# Altium project opo4.PrjPCB
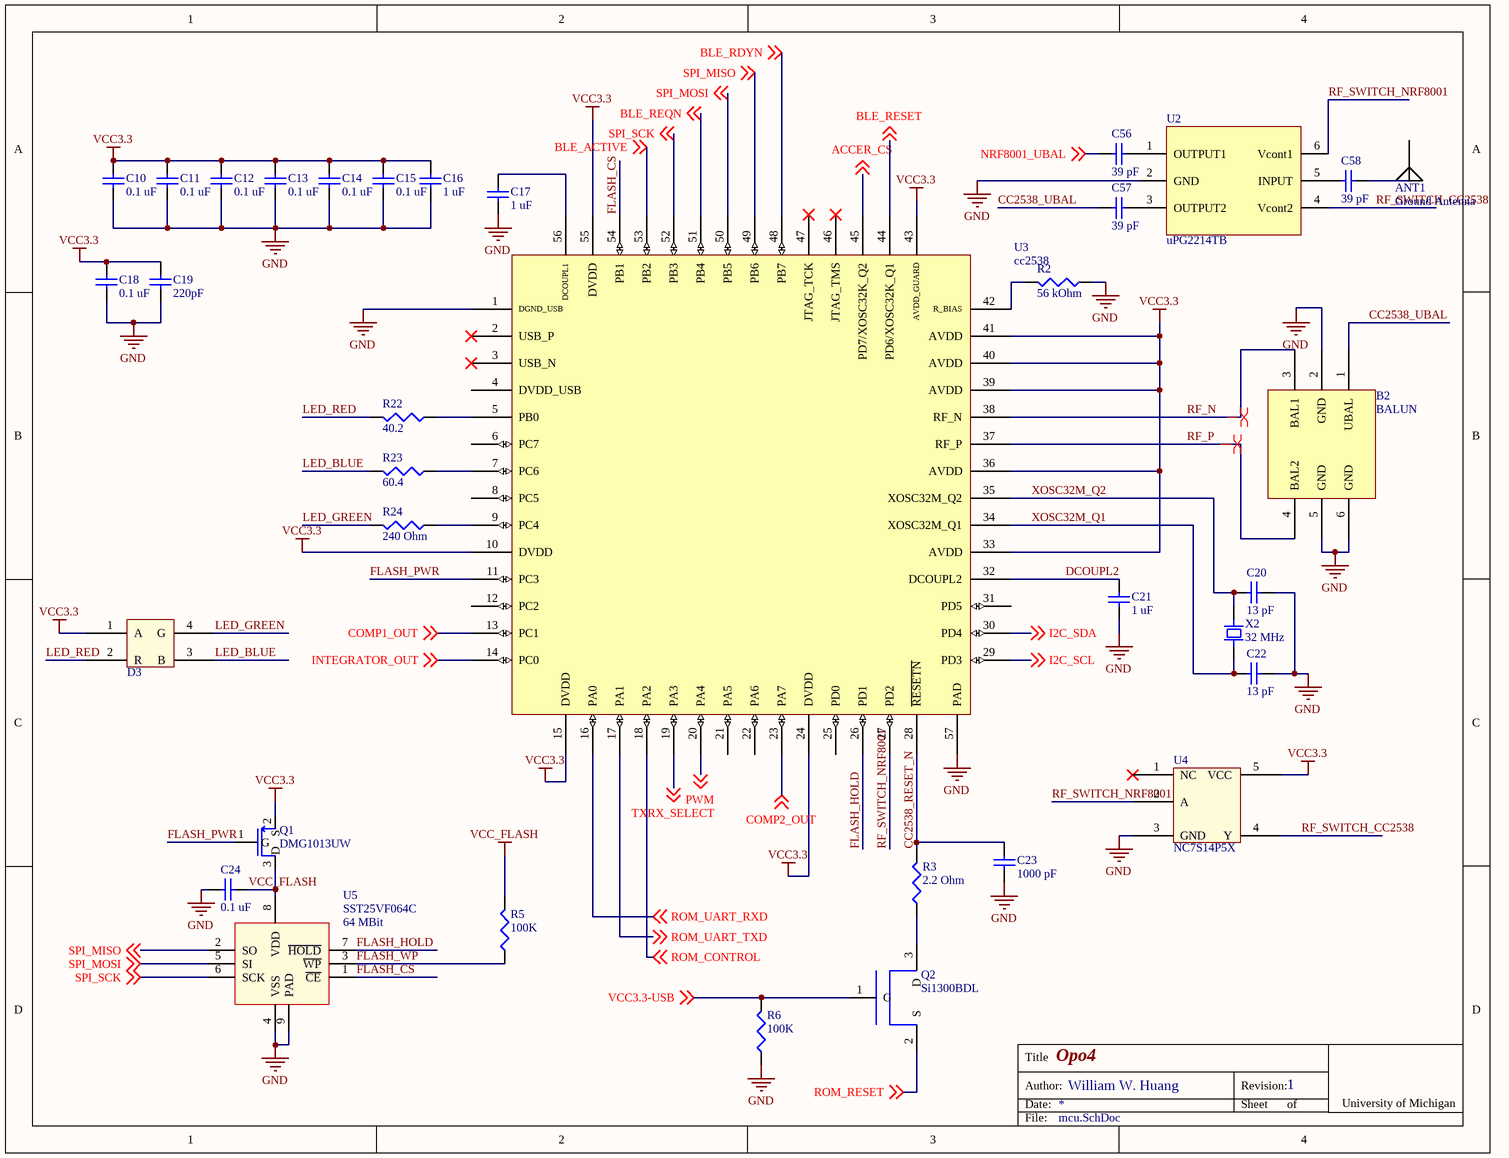
[diagram p0: mcu.SchDoc]
6 sheets, 110 parts. Net scope: global (net labels, ports and power ports of the same name join across sheets).
Board file: opo4.PcbDoc
Sheets:
  mcu.SchDoc
  power.SchDoc
  programmer_charger.SchDoc
  bluetooth.SchDoc
  ul_rx.SchDoc
  ul_tx_ctrl.SchDoc

## Sheet mcu.SchDoc: Opo4
size Letter; Author: William W. Huang; Organization: Altium Limited; Address1: L3, 12a Rodborough Rd; Address2: Frenchs Forest; Address3: NSW; Address4: Australia 2086; Revision: 1

### Parts
ANT1  Ground Antenna  [SMD Ground Antenna]
B2  BALUN  [2450BM15A0002]
C10  value 0.1 uF  [0402]  (hidden comment: Ceramic capacitor)
C11  value 0.1 uF  [0402]  (hidden comment: Ceramic capacitor)
C12  value 0.1 uF  [0402]  (hidden comment: Ceramic capacitor)
C13  value 0.1 uF  [0402]  (hidden comment: Ceramic capacitor)
C14  value 0.1 uF  [0402]  (hidden comment: Ceramic capacitor)
C15  value 0.1 uF  [0402]  (hidden comment: Ceramic capacitor)
C16  value 1 uF  [0402]  (hidden comment: Ceramic capacitor)
C17  value 1 uF  [0402]  (hidden comment: Ceramic capacitor)
C18  value 0.1 uF  [0402]  (hidden comment: Ceramic capacitor)
C19  value 220pF  [0402]  (hidden comment: 220pF 0402 ceramic cap)
C20  value 13 pF  [0402]  (hidden comment: 13pf 0402 Cap)
C21  value 1 uF  [0402]  (hidden comment: Ceramic capacitor)
C22  value 13 pF  [0402]  (hidden comment: 13pf 0402 Cap)
C23  value 1000 pF  [0402]  (hidden comment: Ceramic capacitor)
C24  value 0.1 uF  [0402]  (hidden comment: Ceramic capacitor)
C56  value 39 pF  [0402]  (hidden comment: Ceramic Capacitor)
C57  value 39 pF  [0402]  (hidden comment: Ceramic Capacitor)
C58  value 39 pF  [0402]  (hidden comment: Ceramic Capacitor)
D3  Tri Color LED  [0404]  (value not drawn)
Q1  DMG1013UW  [SC70-3]
Q2  Si1300BDL  [SC70-3]
R2  value 56 kOhm  [0402]  (hidden comment: 56k 0402 Res)
R3  value 2.2 Ohm  [0402]  (hidden comment: 2.2 Ohm 0402 Res)
R5  value 100K  [0402]  (hidden comment: Chip resistor)
R6  value 100K  [0402]  (hidden comment: Chip resistor)
R22  value 40.2  [0201]  (hidden comment: Chip Resistor)
R23  value 60.4  [0201]  (hidden comment: Chip resistor)
R24  value 240 Ohm  [0201]  (hidden comment: Chip resistor)
U2  uPG2214TB  [minimold-6]
U3  cc2538  [QFN50P800X800X100_HS-57N]
U4  NC7S14P5X  [SC70-5]
U5  SST25VF064C  Capacity: 64 MBit  [WSON]
X2  value 32 MHz  [FA-128]  (hidden comment: 32 MHz Crystal)

### Nets
GND: B2.2(GND) B2.5(GND) B2.6(GND) C10.2 C11.2 C12.2 C13.2 C14.2 C15.2 C16.2 C17.2 C18.2 C19.2 C20.2 C21.2 C22.1 C23.2 C24.1 R2.2 R6.2 U2.2(GND) U3.1(DGND_USB) U3.57(PAD) U4.3(GND) U5.4(VSS) U5.9(PAD)
VCC3.3: C10.1 C11.1 C12.1 C13.1 C14.1 C15.1 C16.1 C18.1 C19.1 D3.1(A) Q1.2(S) U3.10(DVDD) U3.15(DVDD) U3.24(DVDD) U3.33(AVDD) U3.36(AVDD) U3.39(AVDD) U3.40(AVDD) U3.41(AVDD) U3.43(AVDD_GUARD) U3.55(DVDD) U4.5(VCC)
VCC_FLASH: C24.2 Q1.3(D) R5.1 U5.8(VDD)
ACCER_CS: U3.45(PD7/XOSC32K_Q2) ; off-sheet ACCER_CS
BLE_ACTIVE: U3.53(PB2) ; off-sheet BLE_ACTIVE
BLE_RDYN: U3.48(PB7) ; off-sheet BLE_RDYN
BLE_REQN: U3.51(PB4) ; off-sheet BLE_REQN
BLE_RESET: U3.44(PD6/XOSC32K_Q1) ; off-sheet BLE_RESET
CC2538_RESET_N: C23.1 R3.1 U3.28(~{RESETN})
CC2538_UBAL: B2.1(UBAL) C57.2
COMP1_OUT: U3.13(PC1) ; off-sheet COMP1_OUT
COMP2_OUT: U3.23(PA7) ; off-sheet COMP2_OUT
DCOUPL2: C21.1 U3.32(DCOUPL2)
FLASH_CS: U3.54(PB1) U5.1(~{CE})
FLASH_HOLD: U3.26(PD1) U5.7(~{HOLD})
FLASH_PWR: Q1.1(G) U3.11(PC3)
FLASH_WP: R5.2 U5.3(~{WP})
I2C_SCL: U3.29(PD3) ; off-sheet I2C_SCL
I2C_SDA: U3.30(PD4) ; off-sheet I2C_SDA
INTEGRATOR_OUT: U3.14(PC0) ; off-sheet INTEGRATOR_OUT
LED_BLUE: D3.3(B) R23.1
LED_GREEN: D3.4(G) R24.1
LED_RED: D3.2(R) R22.1
NRF8001_UBAL: C56.1 ; off-sheet NRF8001_UBAL
PWM: U3.20(PA4) ; off-sheet PWM
RF_N: B2.3(BAL1) U3.38(RF_N)
RF_P: B2.4(BAL2) U3.37(RF_P)
RF_SWITCH_CC2538: U2.4(Vcont2) U4.4(Y)
RF_SWITCH_NRF8001: U2.6(Vcont1) U3.27(PD2) U4.2(A)
ROM_CONTROL: U3.18(PA2) ; off-sheet ROM_CONTROL
ROM_RESET: Q2.2(S) ; off-sheet ROM_RESET
ROM_UART_RXD: U3.16(PA0) ; off-sheet ROM_UART_RXD
ROM_UART_TXD: U3.17(PA1) ; off-sheet ROM_UART_TXD
SPI_MISO: U3.49(PB6) U5.2(SO) ; off-sheet SPI_MISO
SPI_MOSI: U3.50(PB5) U5.5(SI) ; off-sheet SPI_MOSI
SPI_SCK: U3.52(PB3) U5.6(SCK) ; off-sheet SPI_SCK
TXRX_SELECT: U3.19(PA3) ; off-sheet TXRX_SELECT
VCC3.3-USB: Q2.1(G) R6.1 ; off-sheet VCC3.3-USB
XOSC32M_Q1: C22.2 U3.34(XOSC32M_Q1) X2.3
XOSC32M_Q2: C20.1 U3.35(XOSC32M_Q2) X2.1
NetC17_1: C17.1 U3.56(DCOUPL1)
NetC56_2: C56.2 U2.1(OUTPUT1)
NetC57_1: C57.1 U2.3(OUTPUT2)
NetC58_1: C58.1 U2.5(INPUT)
NetQ2_3: Q2.3(D) R3.2
NetR2_1: R2.1 U3.42(R_BIAS)
NetR22_2: R22.2 U3.5(PB0)
NetR23_2: R23.2 U3.7(PC6)
NetR24_2: R24.2 U3.9(PC4)

Not connected (* = marked no-connect by the designer): ANT1 1; C58 2; U3 2(USB_P)* 3(USB_N)* 4(DVDD_USB) 6(PC7) 8(PC5) 12(PC2) 21(PA5) 22(PA6) 25(PD0) 31(PD5) 46(JTAG_TMS)* 47(JTAG_TCK)*; U4 1(NC)*

### Layout directives
differential pair: RF_N, RF_P

### Notes on the sheet
- Title
- Date:
- Author:
- Revision:
- Sheet
- of
- University of Michigan
- File:

### Library data of the parts
ANT1 = Molex Antenna: Molex 2.4 GHz SMD On-Ground Antenna; Supplier 1: Digikey; Supplier Part Number 1: WM4893CT-ND
B2 = cc2538_Balun: Johanson CC253X Balun; Mfr: Johanson Technology; Supplier 1: Digikey; Supplier Part Number 1: 712-1536-1-ND; Mfr Part Number: 2450BM15A0002
C10-C15 C18 C24 = C_0.1u_0402_ceramic: Ceramic capacitor, 0.1u, 0402 package; Manufacture: TDK; voltage rated: 10 V; tolerance: 10%; Supplier 1: Digi-Key; Supplier Part Number 1: 445-1265-1-ND; package: 0402
C16 C17 C21 = C_1u_0402_ceramic: Ceramic capacitor, 1 uF, 0402 package; Manufacture: TDK; voltage rated: 6.3 V; tolerance: 10%; package: 0402; Supplier 1: Digi-Key; Supplier Part Number 1: 445-5000-1-ND
C19 = C_220pf_0402_ceramic: 220pF 5% 50 V C0G NP0 0402 ceramic cap; Mfr: Murata; Mfr Part Number: GRM1555C1H221JA01D; Supplier 1: Digikey; Supplier Part Number 1: 490-1293-1-ND
C20 C22 = C_13p_0402: 13pf, 50V, 2%, c0G, NP0, 0402, ceramic; Mfr: Murata; Mfr Part Number: GRM1555C1H130GA01D; Supplier 1: Digikey; Supplier Part Number 1: 490-8184-1-ND
C23 = C_1000p_0402_ceramic: Ceramic capacitor, 1000 pF, 0402 package; Manufacture: TDK; voltage rated: 50 V; tolerance: 10%; package: 0402; Supplier 1: Digi-Key; Supplier Part Number 1: 445-6846-1-ND
C56-C58 = C_39pf_0402_ceramic: Ceramic capacitor, 0402, 39 pF, 5%, C0G, NP0, RF suitable; Supplier 1: Digikey; Supplier Part Number 1: 720-1288-1-ND
D3 = D_LED_RGB_0404: LED, RGB, 0404; Supplier 1: Digikey; Supplier Part Number 1: SMLP34RGB2W3CT-ND
Q1 = DMG1013UW: P-CHANNEL ENHANCEMENT MODE MOSFET; Supplier 1: Digi-Key; Supplier Part Number 1: DMG1013UW-7DICT-ND
Q2 = Si1300BDL: MOSFET N-CH D-S 20V SC-70-3; Supplier 1: Digi-Key; Supplier Part Number 1: SI1300BDL-T1-GE3CT-ND
R2 = R_56K_0402: 56 kOhm, 1%, .0603 W, 0402; Mfr: Rohm; Mfr Part Number: MCR01MRTF5602; Supplier 1: Digikey; Supplier Part Number 1: RHM56.0KCDCT-ND
R3 = R_2.2_0402: 2.2 Ohm, 1%, .063W, 0402; Mfr: Vishay Dale; Mfr Part Number: CRCW04022R20FKED; Supplier 1: Digikey; Supplier Part Number 1: 541-2.20LLCT-ND
R5 R6 = R_100K_0402: Chip resistor, 100K, 0402 package; tolerance: 1%; power: 1/16 W; Supplier 1: Digi-Key; Supplier Part Number 1: 541-100KLCT-ND; package: 0402
R22 = R_40.2_0201: 40.2 Ohm 0201 1% Chip Resistor; Supplier 1: Digikey; Supplier Part Number 1: 1276-3586-1-ND
R23 = R_60.4_0201: 60.4 Ohm, .05W, 1% 0201 Chip Resistor; Supplier 1: DIgikey; Supplier Part Number 1: P60.4ABCT-ND
R24 = R_240_0201: 240 Ohm, 1%, .05W, 0201 Chip Resistor; Supplier 1: Digikey; Supplier Part Number 1: P240AGCT-ND
U2 = uPG2214TB: GaAs Integrated Circuit for L, S-Band SPDT Switch; Supplier 1: Digi-Key; Supplier Part Number 1: UPG2214TB-E4-ACT-ND
U3 = cc2538: cc2538 MCU/802.15.4 radio; Supplier 1: Digikey; Supplier Part Number 1: 296-35797-1-ND
U4 = NC7S14P5X: Single Inverter; Mfr: Fairchild; Mfr Part Number: NC7S14P5X; Supplier 1: Digikey; Supplier Part Number 1: NC7S14P5XDKR-ND
U5 = SST25VF064C: 64 Mbit SPI Serial Dual I/O Flash; Supplier 1: Digi-Key; Supplier Part Number 1: SST25VF064C-80-4I-Q2AE-CT-ND
X2 = X_32M_FA-128: 32MHz, 10ppm, 10pF, 60 Ohm; Mfr: Epson; Mfr Part Number: FA-128 32.0000MF20X-K3; Supplier 1: Digikey; Supplier Part Number 1: SER3800CT-ND

## Sheet power.SchDoc: Opo4
size Letter; Author: William W. Huang; Organization: Altium Limited; Address1: L3, 12a Rodborough Rd; Address2: Frenchs Forest; Address3: NSW; Address4: Australia 2086; Revision: 1
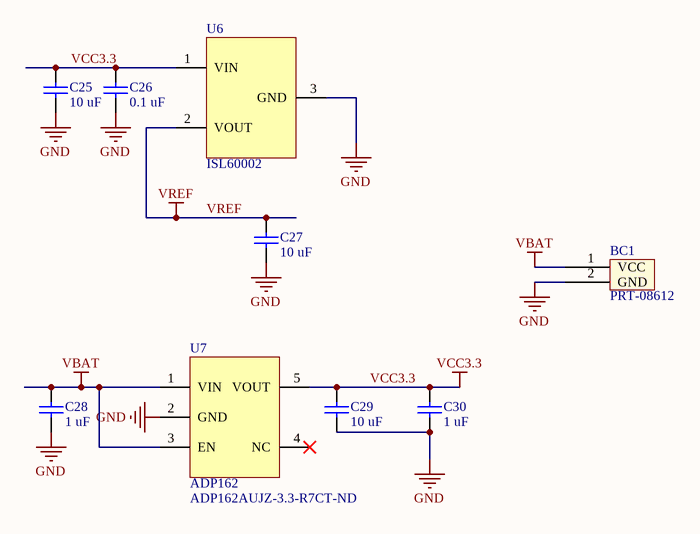
[diagram p1: power.SchDoc]

### Parts
BC1  PRT-08612  [JST PH 2PIN]
C25  value 10 uF  [0603]  (hidden comment: Ceramic capacitor)
C26  value 0.1 uF  [0402]  (hidden comment: Ceramic capacitor)
C27  value 10 uF  [0603]  (hidden comment: Ceramic capacitor)
C28  value 1 uF  [0402]  (hidden comment: Ceramic capacitor)
C29  value 10 uF  [0603]  (hidden comment: Ceramic capacitor)
C30  value 1 uF  [0402]  (hidden comment: Ceramic capacitor)
U6  ISL60002  [SOT23-3N]
U7  ADP162  Supplier Part Number 1: ADP162AUJZ-3.3-R7CT-ND  [TSOT23-5]

### Nets
GND: BC1.2(GND) C25.2 C26.2 C27.2 C28.2 C29.2 C30.2 U6.3(GND) U7.2(GND)
VBAT: BC1.1(VCC) C28.1 U7.1(VIN) U7.3(EN)
VCC3.3: C25.1 C26.1 C29.1 C30.1 U6.1(VIN) U7.5(VOUT)
VREF: C27.1 U6.2(VOUT)

Not connected (* = marked no-connect by the designer): BC1 3 4; U7 4(NC)*

### Notes on the sheet
- Title
- Date:
- Author:
- Revision:
- Sheet
- of
- University of Michigan
- File:

### Library data of the parts
BC1 = JST-PH-2mm-2Pin: 2-pin JST-PH 2mm Battery Connector; Supplier 1: Sparkfun; Supplier Part Number 1: PRT-08612
C25 C27 C29 = C_10u_0603_ceramic: Ceramic capacitor, 10 uF, 0603 package; Manufacture: TDK; voltage rated: 6.3V; tolerance: 20%; package: 0603; Supplier 1: Digi-Key; Supplier Part Number 1: 445-4112-1-ND
C26 = C_0.1u_0402_ceramic: as C10 on sheet mcu; Supplier 1: Digi-Key; Supplier Part Number 1: 445-1265-1-ND; package: 0402
C28 C30 = C_1u_0402_ceramic: as C16 on sheet mcu; package: 0402; Supplier 1: Digi-Key; Supplier Part Number 1: 445-5000-1-ND
U6 = ISL60002: IC VREF SERIES PREC SOT-23-3; Supplier 1: Digi-Key; Supplier Part Number 1: ISL60002DIH310Z-TKCT-ND
U7 = ADP162: Ultralow Quiescent Current,  150 mA, CMOS Linear Regulators; Supplier 1: Digi-Key

## Sheet programmer_charger.SchDoc: Opo4
size Letter; Author: William W. Huang; Organization: Altium Limited; Address1: L3, 12a Rodborough Rd; Address2: Frenchs Forest; Address3: NSW; Address4: Australia 2086; Revision: 1
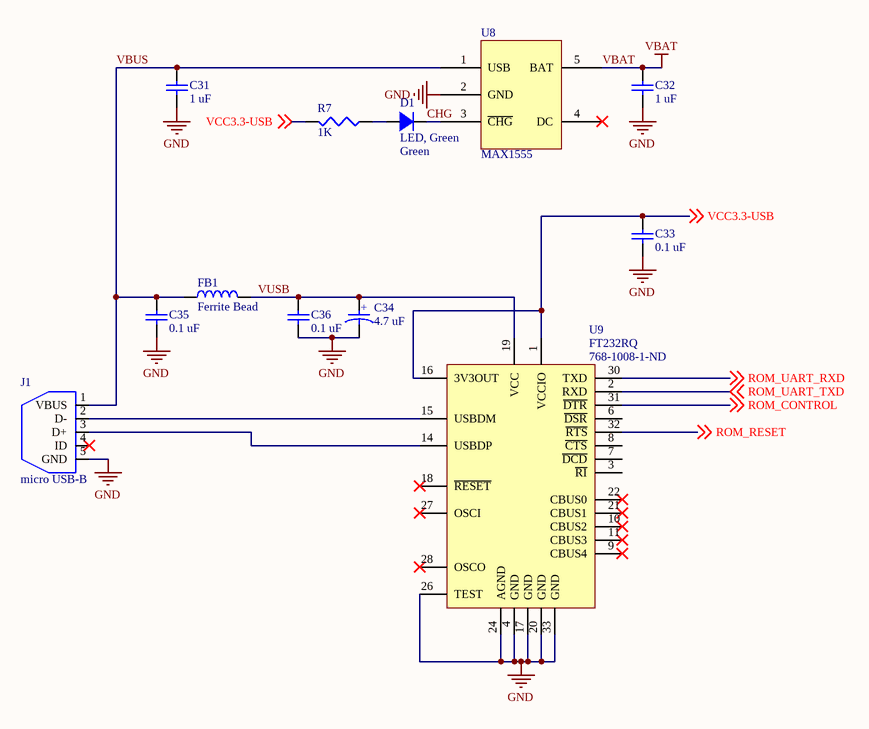
[diagram p2: programmer_charger.SchDoc]

### Parts
C31  value 1 uF  [0402]  (hidden comment: Ceramic capacitor)
C32  value 1 uF  [0402]  (hidden comment: Ceramic capacitor)
C33  value 0.1 uF  [0402]  (hidden comment: Ceramic capacitor)
C34  value 4.7 uF  [0603 - Polar Marking]  (hidden comment: Tantalum capacitor)
C35  value 0.1 uF  [0402]  (hidden comment: Ceramic capacitor)
C36  value 0.1 uF  [0402]  (hidden comment: Ceramic capacitor)
D1  LED, Green  Color: Green  [0402 - DIODE]
FB1  Ferrite Bead  [0402]
J1  micro USB-B  [Micro USB-B]
R7  value 1K  [0402]  (hidden comment: Chip resistor)
U8  MAX1555  [SOT23-5]
U9  FT232RQ  Supplier Part Number 1: 768-1008-1-ND  [QFN-32]

### Nets
GND: C31.2 C32.2 C33.2 C34.2 C35.2 C36.2 J1.5(GND) U8.2(GND) U9.4(GND) U9.17(GND) U9.20(GND) U9.24(AGND) U9.26(TEST) U9.33(GND)
VBAT: C32.1 U8.5(BAT)
CHG: D1.2 U8.3(~{CHG})
ROM_CONTROL: U9.31(~{DTR}) ; off-sheet ROM_CONTROL
ROM_RESET: U9.32(~{RTS}) ; off-sheet ROM_RESET
ROM_UART_RXD: U9.30(TXD) ; off-sheet ROM_UART_RXD
ROM_UART_TXD: U9.2(RXD) ; off-sheet ROM_UART_TXD
VBUS: C31.1 C35.1 FB1.2 J1.1(VBUS) U8.1(USB)
VCC3.3-USB: C33.1 R7.1 U9.1(VCCIO) U9.16(3V3OUT) ; off-sheet VCC3.3-USB
VUSB: C34.1 C36.1 FB1.1 U9.19(VCC)
NetD1_1: D1.1 R7.2
NetJ1_2: J1.2(D-) U9.15(USBDM)
NetJ1_3: J1.3(D+) U9.14(USBDP)

Not connected (* = marked no-connect by the designer): J1 4(ID)*; U8 4(DC)*; U9 3(~{RI}) 6(~{DSR}) 7(~{DCD}) 8(~{CTS}) 9(CBUS4)* 10(CBUS2)* 11(CBUS3)* 18(~{RESET})* 21(CBUS1)* 22(CBUS0)* 27(OSCI)* 28(OSCO)*

### Notes on the sheet
- Title
- Date:
- Author:
- Revision:
- Sheet
- of
- University of Michigan
- File:
- (in symbol C_4.7u_0603_tantalum) +

### Library data of the parts
C31 C32 = C_1u_0402_ceramic: as C16 on sheet mcu; package: 0402; Supplier 1: Digi-Key; Supplier Part Number 1: 445-5000-1-ND
C33 C35 C36 = C_0.1u_0402_ceramic: as C10 on sheet mcu; Supplier 1: Digi-Key; Supplier Part Number 1: 445-1265-1-ND; package: 0402
C34 = C_4.7u_0603_tantalum: Tantalum capacitor, 4.7 uF, 0603 package; Manufacture: Rohm; voltage rated: 10 V; tolerance: 20%; package: 0603; Supplier 1: Digi-Key; Supplier Part Number 1: 511-1496-1-ND
D1 = D_LED_GREEN_0402: LED, Green,  0402; package: 0402; Supplier 1: Digi-Key; Supplier Part Number 1: 511-1592-1-ND
FB1 = FB_150mA_0402: Ferrite Bead, 150 mA, 0402 package; impedance@Freq: 1K@100 MHz; current rating: 150 mA; Supplier 1: Digi-Key; Supplier Part Number 1: 587-1835-1-ND; package: 0402
J1 = Micro USB: CONN USB MICRO B RECPT SMT R/A; Supplier 1: Digi-Key; Supplier Part Number 1: 609-4616-6-ND
R7 = R_1K_0402: Chip resistor, 1K, 0402 package; tolerance: 1%; power: 1/16 W; Supplier 1: Digi-Key; Supplier Part Number 1: 541-1.00KLCT-ND; package: 0402
U8 = MAX1555: 3 Dual-Input USB/AC Adapter 1-Cell Li+  Battery Chargers; Supplier 1: Digi-Key; Supplier Part Number 1: MAX1555EZK+TTR-ND
U9 = IC_FT232RQ: FT232R USB UART; Manufacturer: *; Note: *; ManufacturerPartNo: *; Supplier 1: Digi-Key

## Sheet bluetooth.SchDoc: Opo4
size Letter; Author: William W. Huang; Organization: Altium Limited; Address1: L3, 12a Rodborough Rd; Address2: Frenchs Forest; Address3: NSW; Address4: Australia 2086; Revision: 1
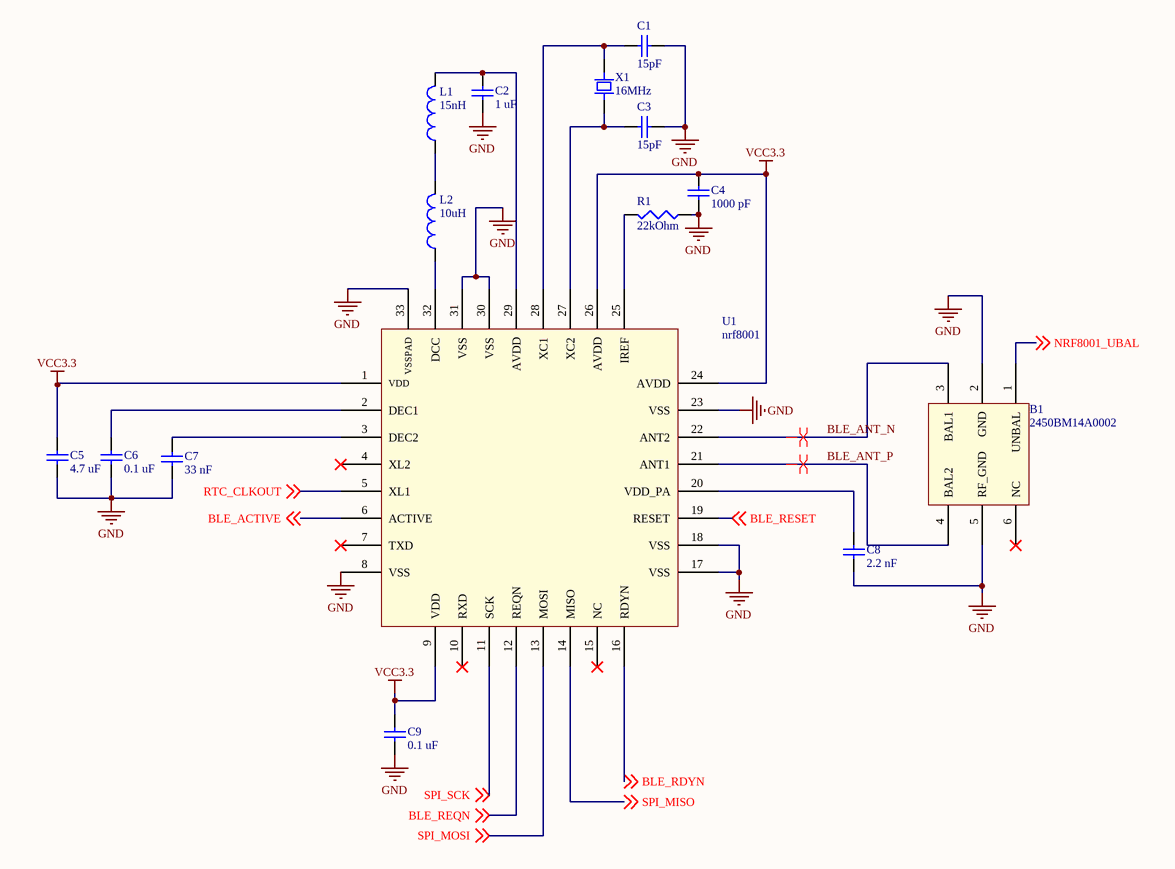
[diagram p3: bluetooth.SchDoc]

### Parts
B1  2450BM14A0002  [2450BM14A0002]
C1  value 15pF  [0402]  (hidden comment: 15pF 0402 ceramic cap)
C2  value 1 uF  [0402]  (hidden comment: Ceramic capacitor)
C3  value 15pF  [0402]  (hidden comment: 15pF 0402 ceramic cap)
C4  value 1000 pF  [0402]  (hidden comment: Ceramic capacitor)
C5  value 4.7 uF  [0402]  (hidden comment: 4.7uF)
C6  value 0.1 uF  [0402]  (hidden comment: Ceramic capacitor)
C7  value 33 nF  [0402]  (hidden comment: 33 nF Cap)
C8  value 2.2 nF  [0402]  (hidden comment: 2.2nF Cap)
C9  value 0.1 uF  [0402]  (hidden comment: Ceramic capacitor)
L1  value 15nH  [0402]  (hidden comment: 15nH chip inductor)
L2  value 10uH  [0603]  (hidden comment: 10uH chip inductor)
R1  value 22kOhm  [0402]  (hidden comment: 22k 0402 resistor)
U1  nrf8001  [QFN50P500X500X90_HS-33N]
X1  value 16MHz  [TSX-3225]  (hidden comment: 16MHz Crystal)

### Nets
GND: B1.2(GND) B1.5(RF_GND) C1.2 C2.2 C3.1 C4.2 C5.2 C6.2 C7.2 C8.2 C9.2 R1.2 U1.8(VSS) U1.17(VSS) U1.18(VSS) U1.23(VSS) U1.30(VSS) U1.31(VSS) U1.33(VSSPAD) X1.2 X1.4
VCC3.3: C4.1 C5.1 C9.1 U1.1(VDD) U1.9(VDD) U1.24(AVDD) U1.26(AVDD)
BLE_ACTIVE: U1.6(ACTIVE) ; off-sheet BLE_ACTIVE
BLE_ANT_N: B1.3(BAL1) U1.22(ANT2)
BLE_ANT_P: B1.4(BAL2) U1.21(ANT1)
BLE_RDYN: U1.16(RDYN) ; off-sheet BLE_RDYN
BLE_REQN: U1.12(REQN) ; off-sheet BLE_REQN
BLE_RESET: U1.19(RESET) ; off-sheet BLE_RESET
NRF8001_UBAL: B1.1(UNBAL) ; off-sheet NRF8001_UBAL
RTC_CLKOUT: U1.5(XL1) ; off-sheet RTC_CLKOUT
SPI_MISO: U1.14(MISO) ; off-sheet SPI_MISO
SPI_MOSI: U1.13(MOSI) ; off-sheet SPI_MOSI
SPI_SCK: U1.11(SCK) ; off-sheet SPI_SCK
NetC1_1: C1.1 U1.28(XC1) X1.1
NetC2_1: C2.1 L1.1 U1.29(AVDD)
NetC3_2: C3.2 U1.27(XC2) X1.3
NetC6_1: C6.1 U1.2(DEC1)
NetC7_1: C7.1 U1.3(DEC2)
NetC8_1: C8.1 U1.20(VDD_PA)
NetL1_2: L1.2 L2.1
NetL2_2: L2.2 U1.32(DCC)
NetR1_1: R1.1 U1.25(IREF)

Not connected (* = marked no-connect by the designer): B1 6(NC)*; U1 4(XL2)* 7(TXD)* 10(RXD)* 15(NC)*

### Layout directives
differential pair: BLE_ANT_N, BLE_ANT_P

### Notes on the sheet
- Title
- Date:
- Author:
- Revision:
- Sheet
- of
- University of Michigan
- File:

### Library data of the parts
B1 = nrf8001_balun: nrf8001 chip balun; Mfr: Johanson; Mfr Part Number: 2450BM14A0002; Supplier 1: Digikey; Supplier Part Number 1: 712-1574-1-ND
C1 C3 = C_15p_0402_ceramic: 15pF, 2%, NP0, 0402; Mfr: Murata; Mfr Part Number: GRM1555C1H150GA01D; Supplier 1: Digikey; Supplier Part Number 1: 490-6201-1-ND
C2 = C_1u_0402_ceramic: as C16 on sheet mcu; package: 0402; Supplier 1: Digi-Key; Supplier Part Number 1: 445-5000-1-ND
C4 = C_1000p_0402_ceramic: as C23 on sheet mcu; package: 0402; Supplier 1: Digi-Key; Supplier Part Number 1: 445-6846-1-ND
C5 = C_4.7u_0402_ceramic: 4.7 uF 10% 0402 6.3V X5R ceramic cap; Manufacturer: TDK; Supplier 1: Digikey; Supplier Part Number 1: 445-5947-1-ND
C6 C9 = C_0.1u_0402_ceramic: as C10 on sheet mcu; Supplier 1: Digi-Key; Supplier Part Number 1: 445-1265-1-ND; package: 0402
C7 = C_0.033uF_0402_ceramic: 33nF 10% 0402 16V X7R ceramic cap; Manufacturer: Samsung; Supplier 1: Digikey; Supplier Part Number 1: 1276-1177-1-ND
C8 = C_2.2n_0402_ceramic: 2.2nF 10% 50V X7R ceramic cap; Manufacturer: TDK; Supplier 1: Digikey; Supplier Part Number 1: 445-1257-1-ND
L1 = L_15nH_0402: 15 nH, 5%, 460mOhm, 2.3Ghz, 0402 chip inductor; Mfr: Taiyo Yuden; Mfr Part Number: HK100515NJ-T; Supplier 1: Digikey; Supplier Part Number 1: 587-1521-1-ND
L2 = L_10u_0603: 10uH, 10%, 32MHz, 468 mOhm, 0603, chip inductor; Mfr: Taiyo Yuden; Mfr Part Number: LBMF1608T100K; Supplier 1: Digikey; Supplier Part Number 1: 587-1714-1-ND
R1 = R_22k_0402: 22k 1% .063W 0402 resistor; Mfr: Samsung; Mfr Part Number: RC1005F223CS; Supplier 1: Digikey; Supplier Part Number 1: 1276-4143-1-ND
U1 = nrf8001: nrf8001 Bluetooth SPI module; Supplier 1: Digikey; Supplier Part Number 1: 1490-1026-ND
X1 = TSX-3225: 3.2x2.5mm 16MHz SMD crystal; Mfr: Epson; Mfr part Number: TSX-3225 16.0000MF09Z-AC3; Supplier 1: Digikey; Supplier Part Number 1: SER3628CT-ND

## Sheet ul_rx.SchDoc: Opo4
size Letter; Author: William W. Huang; Organization: Altium Limited; Address1: L3, 12a Rodborough Rd; Address2: Frenchs Forest; Address3: NSW; Address4: Australia 2086; Revision: 1
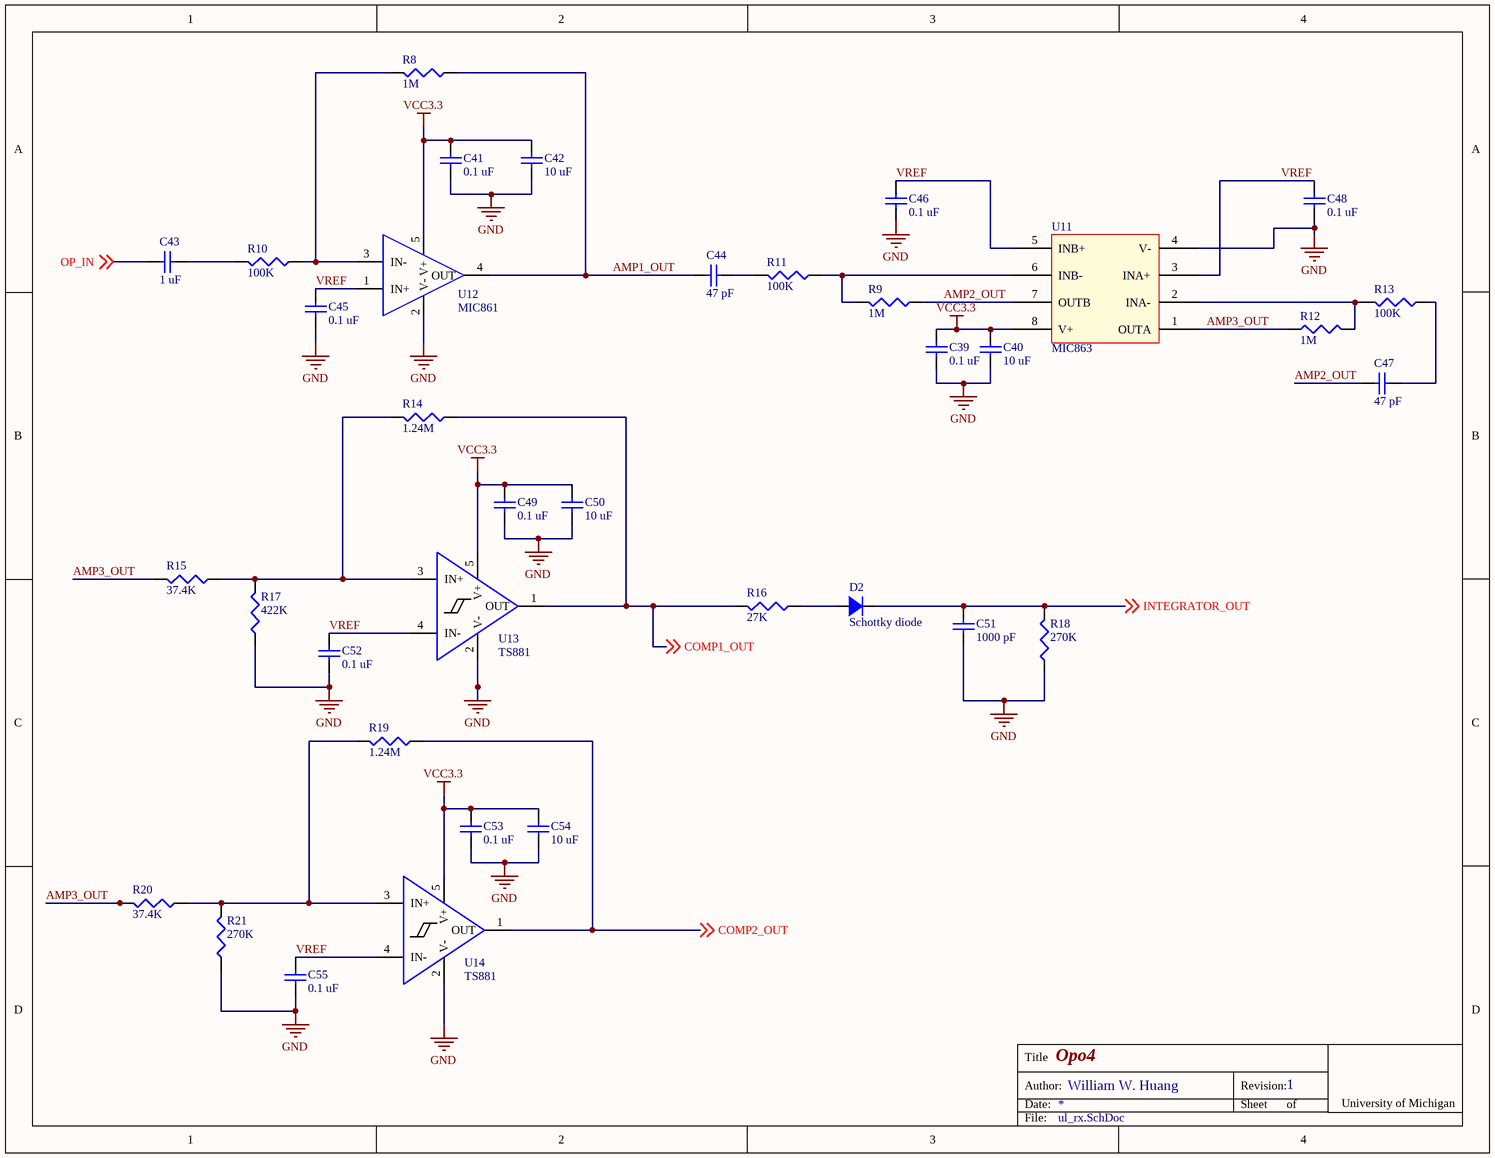
[diagram p4: ul_rx.SchDoc]

### Parts
C39  value 0.1 uF  [0402]  (hidden comment: Ceramic capacitor)
C40  value 10 uF  [0402]  (hidden comment: Ceramic capacitor)
C41  value 0.1 uF  [0402]  (hidden comment: Ceramic capacitor)
C42  value 10 uF  [0402]  (hidden comment: Ceramic capacitor)
C43  value 1 uF  [0402]  (hidden comment: Ceramic capacitor)
C44  value 47 pF  [0402]  (hidden comment: Ceramic capacitor)
C45  value 0.1 uF  [0402]  (hidden comment: Ceramic capacitor)
C46  value 0.1 uF  [0402]  (hidden comment: Ceramic capacitor)
C47  value 47 pF  [0402]  (hidden comment: Ceramic capacitor)
C48  value 0.1 uF  [0402]  (hidden comment: Ceramic capacitor)
C49  value 0.1 uF  [0402]  (hidden comment: Ceramic capacitor)
C50  value 10 uF  [0402]  (hidden comment: Ceramic capacitor)
C51  value 1000 pF  [0402]  (hidden comment: Ceramic capacitor)
C52  value 0.1 uF  [0402]  (hidden comment: Ceramic capacitor)
C53  value 0.1 uF  [0402]  (hidden comment: Ceramic capacitor)
C54  value 10 uF  [0402]  (hidden comment: Ceramic capacitor)
C55  value 0.1 uF  [0402]  (hidden comment: Ceramic capacitor)
D2  Schottky diode  [0603 - DIODE]
R8  value 1M  [0402]  (hidden comment: Chip resistor)
R9  value 1M  [0402]  (hidden comment: Chip resistor)
R10  value 100K  [0402]  (hidden comment: Chip resistor)
R11  value 100K  [0402]  (hidden comment: Chip resistor)
R12  value 1M  [0402]  (hidden comment: Chip resistor)
R13  value 100K  [0402]  (hidden comment: Chip resistor)
R14  value 1.24M  [0402]  (hidden comment: Chip resistor)
R15  value 37.4K  [0402]  (hidden comment: Chip resistor)
R16  value 27K  [0402]  (hidden comment: Chip resistor)
R17  value 422K  [0402]  (hidden comment: Chip resistor)
R18  value 270K  [0402]  (hidden comment: Chip resistor)
R19  value 1.24M  [0402]  (hidden comment: Chip resistor)
R20  value 37.4K  [0402]  (hidden comment: Chip resistor)
R21  value 270K  [0402]  (hidden comment: Chip resistor)
U11  MIC863  [TSOP65P280X145-8N]
U12  MIC861  [SC70-5]
U13  TS881  [SC70-5]
U14  TS881  [SC70-5]

### Nets
GND: C39.2 C40.2 C41.2 C42.2 C45.2 C46.2 C48.2 C49.2 C50.2 C51.2 C52.2 C53.2 C54.2 C55.2 R17.2 R18.2 R21.2 U11.4(V-) U12.2(V-) U13.2(V-) U14.2(V-)
VCC3.3: C39.1 C40.1 C41.1 C42.1 C49.1 C50.1 C53.1 C54.1 U11.8(V+) U12.5(V+) U13.5(V+) U14.5(V+)
VREF: C45.1 C46.1 C48.1 C52.1 C55.1 U11.3(INA+) U11.5(INB+) U12.1(IN+) U13.4(IN-) U14.4(IN-)
AMP1_OUT: C44.1 R8.2 U12.4(OUT)
AMP2_OUT: C47.1 R9.2 U11.7(OUTB)
AMP3_OUT: R12.2 R15.1 R20.1 U11.1(OUTA)
COMP1_OUT: R14.2 R16.1 U13.1(OUT) ; off-sheet COMP1_OUT
COMP2_OUT: R19.2 U14.1(OUT) ; off-sheet COMP2_OUT
INTEGRATOR_OUT: C51.1 D2.2 R18.1 ; off-sheet INTEGRATOR_OUT
OP_IN: C43.1 ; off-sheet OP_IN
NetC43_2: C43.2 R10.1
NetC44_2: C44.2 R11.1
NetC47_2: C47.2 R13.2
NetD2_1: D2.1 R16.2
NetR8_1: R8.1 R10.2 U12.3(IN-)
NetR9_1: R9.1 R11.2 U11.6(INB-)
NetR12_1: R12.1 R13.1 U11.2(INA-)
NetR14_1: R14.1 R15.2 R17.1 U13.3(IN+)
NetR19_1: R19.1 R20.2 R21.1 U14.3(IN+)

### Notes on the sheet
- Title
- Date:
- Author:
- Revision:
- Sheet
- of
- University of Michigan
- File:

### Library data of the parts
C39 C41 C45 C46 C48 C49 C52 C53 C55 = C_0.1u_0402_ceramic: as C10 on sheet mcu; Supplier 1: Digi-Key; Supplier Part Number 1: 445-1265-1-ND; package: 0402
C40 C42 C50 C54 = C_10u_0402_ceramic: Ceramic capacitor, 10 uF, 0402 package; Manufacture: TDK; voltage rated: 4V; tolerance: 20%; package: 0402; Supplier 1: Digi-Key; Supplier Part Number 1: 445-8919-1-ND
C43 = C_1u_0402_ceramic: as C16 on sheet mcu; package: 0402; Supplier 1: Digi-Key; Supplier Part Number 1: 445-5000-1-ND
C44 C47 = C_47p_0402_ceramic: Ceramic capacitor, 47 pF, 0402 package; Manufacture: Johanson; voltage rated: 50 V; tolerance: 5%; package: 0402; Supplier 1: Digi-Key; Supplier Part Number 1: 709-1121-1-ND
C51 = C_1000p_0402_ceramic: as C23 on sheet mcu; package: 0402; Supplier 1: Digi-Key; Supplier Part Number 1: 445-6846-1-ND
D2 = D_SCHOTTKY_30V_0.1A_0603: Schottky diode 30 V 0.1 A 0603; package: 0603; Supplier 1: Digi-Key; Supplier Part Number 1: 641-1282-1-ND
R8 R9 R12 = R_1M_0402: Chip resistor, 1M, 0402 package; tolerance: 1%; power: 1/16 W; Supplier 1: Digi-Key; Supplier Part Number 1: 541-1.00MLCT-ND; package: 0402
R10 R11 R13 = R_100K_0402: as R5 on sheet mcu; Supplier 1: Digi-Key; Supplier Part Number 1: 541-100KLCT-ND; package: 0402
R14 R19 = R_1.24M_0402: Chip resistor, 1.24M, 0402 package; tolerance: 1%; power: 1/16 W; package: 0402; Supplier 1: Digi-Key; Supplier Part Number 1: 541-1.24MLCT-ND
R15 R20 = R_37.4K_0402: Chip resistor, 37.4K, 0402 package; tolerance: 1%; power: 1/16 W; package: 0402; Supplier 1: Digi-Key; Supplier Part Number 1: 541-37.4KLCT-ND
R16 = R_27K_0402: Chip resistor, 27K, 0402 package; tolerance: 1%; power: 1/16 W; package: 0402; Supplier 1: Digi-Key; Supplier Part Number 1: 541-27.0KLCT-ND
R17 = R_422K_0402: Chip resistor, 422K, 0402 package; tolerance: 1%; power: 1/16 W; package: 0402; Supplier 1: Digi-Key; Supplier Part Number 1: 541-422KLCT-ND
R18 R21 = R_270K_0402: Chip resistor, 270K, 0402 package; tolerance: 1%; power: 1/16 W; package: 0402; Supplier 1: Digi-Key; Supplier Part Number 1: 541-270KLCT-ND
U11 = MIC863: Dual Ultra Low Power Op Amp in SOT23-8; Supplier 1: Digi-Key; Supplier Part Number 1: 576-2934-1-ND
U12 = MIC861: IC OPAMP 400KHZ 2.7V ULT LP SC70; Supplier 1: Digi-Key; Supplier Part Number 1: 576-2932-1-ND
U13 U14 = TS881: Rail-to-rail 1.1 V nanopower comparator; Supplier 1: Digi-Key; Supplier Part Number 1: 497-13217-1-ND

## Sheet ul_tx_ctrl.SchDoc: Opo4
size Letter; Author: William W. Huang; Organization: Altium Limited; Address1: L3, 12a Rodborough Rd; Address2: Frenchs Forest; Address3: NSW; Address4: Australia 2086; Revision: 1
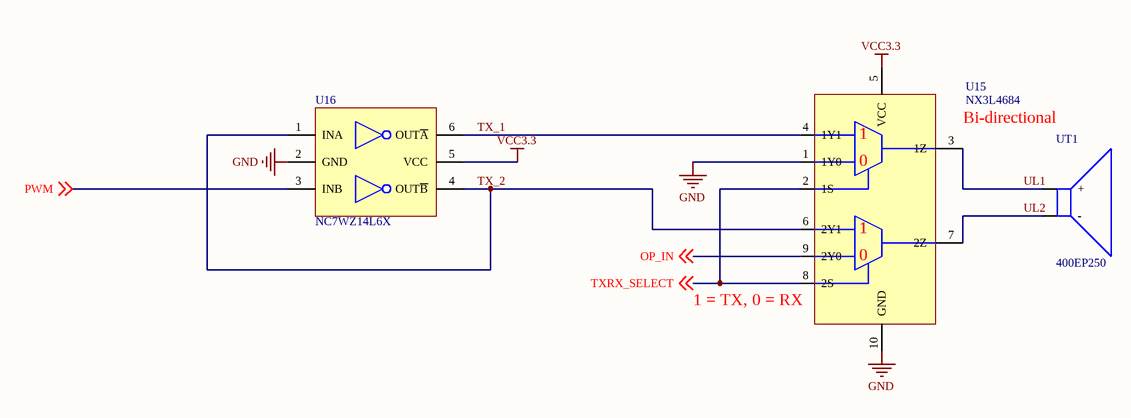
[diagram p5: ul_tx_ctrl.SchDoc]

### Parts
U15  NX3L4684  [QFN50P155X200X13-10N]
U16  NC7WZ14L6X  [NC7WZ14L6X]
UT1  400EP250  [Transducer recepticle]

### Nets
GND: U15.1(1Y0) U15.10(GND) U16.2(GND)
VCC3.3: U15.5(VCC) U16.5(VCC)
OP_IN: U15.9(2Y0) ; off-sheet OP_IN
PWM: U16.3(INB) ; off-sheet PWM
TX_1: U15.4(1Y1) U16.6(OUT~{A})
TX_2: U15.6(2Y1) U16.1(INA) U16.4(OUT~{B})
TXRX_SELECT: U15.2(1S) U15.8(2S) ; off-sheet TXRX_SELECT
UL1: U15.3(1Z) UT1.2(+)
UL2: U15.7(2Z) UT1.1(-)

### Notes on the sheet
- (near U15) Bi-directional
- (near U15) 1 = TX, 0 = RX
- Title
- Date:
- Author:
- Revision:
- Sheet
- of
- University of Michigan
- File:
- (in symbol NX3L4684) 0

### Library data of the parts
U15 = NX3L4684: IC ANALOG SWITCH SPDT 10XQFN; Supplier 1: Digi-Key; Supplier Part Number 1: 568-5564-1-ND
U16 = NC7WZ14L6X: 1 uA supply current, 50 mA output current, Dual inverter; Mfr: Fairchild Semiconductor; Supplier 1: Digikey; Supplier Part Number 1: NC7WZ14L6XFSCT-ND; Mfr Part Number: NC7WZ14L6X
UT1 = Tranducer: Air Ultrasounic Ceramic Transducers; Supplier 1: Digi-Key; Supplier Part Number 1: ED90088-ND

## Nets that join several sheets
GND: mcu (26 pins), power (9 pins), programmer_charger (14 pins), bluetooth (21 pins), ul_rx (21 pins), ul_tx_ctrl (U15.1 U15.10 U16.2)
VBAT: power (BC1.1 C28.1 U7.1 U7.3), programmer_charger (C32.1 U8.5)
VCC3.3: mcu (22 pins), power (6 pins), bluetooth (7 pins), ul_rx (12 pins), ul_tx_ctrl (U15.5 U16.5)
VREF: power (C27.1 U6.2), ul_rx (10 pins)
BLE_ACTIVE: mcu (U3.53), bluetooth (U1.6)
BLE_RDYN: mcu (U3.48), bluetooth (U1.16)
BLE_REQN: mcu (U3.51), bluetooth (U1.12)
BLE_RESET: mcu (U3.44), bluetooth (U1.19)
COMP1_OUT: mcu (U3.13), ul_rx (R14.2 R16.1 U13.1)
COMP2_OUT: mcu (U3.23), ul_rx (R19.2 U14.1)
INTEGRATOR_OUT: mcu (U3.14), ul_rx (C51.1 D2.2 R18.1)
NRF8001_UBAL: mcu (C56.1), bluetooth (B1.1)
OP_IN: ul_rx (C43.1), ul_tx_ctrl (U15.9)
PWM: mcu (U3.20), ul_tx_ctrl (U16.3)
ROM_CONTROL: mcu (U3.18), programmer_charger (U9.31)
ROM_RESET: mcu (Q2.2), programmer_charger (U9.32)
ROM_UART_RXD: mcu (U3.16), programmer_charger (U9.30)
ROM_UART_TXD: mcu (U3.17), programmer_charger (U9.2)
SPI_MISO: mcu (U3.49 U5.2), bluetooth (U1.14)
SPI_MOSI: mcu (U3.50 U5.5), bluetooth (U1.13)
SPI_SCK: mcu (U3.52 U5.6), bluetooth (U1.11)
TXRX_SELECT: mcu (U3.19), ul_tx_ctrl (U15.2 U15.8)
VCC3.3-USB: mcu (Q2.1 R6.1), programmer_charger (C33.1 R7.1 U9.1 U9.16)